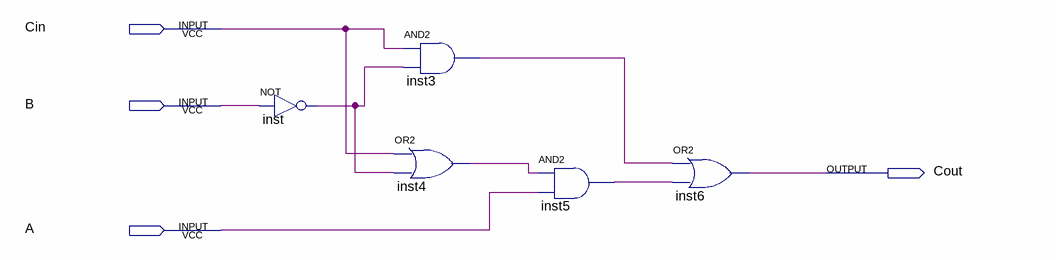
[diagram p0: schematic sheet]
// Quartus schematic maior_bit_menos_significativo.bdf as structural Verilog: 5 symbols, 4 pins
module maior_bit_menos_significativo (
  input  Cin,
  input  B,
  input  A,
  output Cout
);

  wire inst3_out, inst4_out, inst5_out, inst_out;

  not inst (inst_out, B);
  and inst3 (inst3_out, Cin, inst_out);
  or inst4 (inst4_out, Cin, inst_out);
  and inst5 (inst5_out, inst4_out, A);
  or inst6 (Cout, inst3_out, inst5_out);
endmodule
